# Altium schematic sheet Sheet1.SchDoc
size A2; SheetNumber: 1; SheetTotal: 1
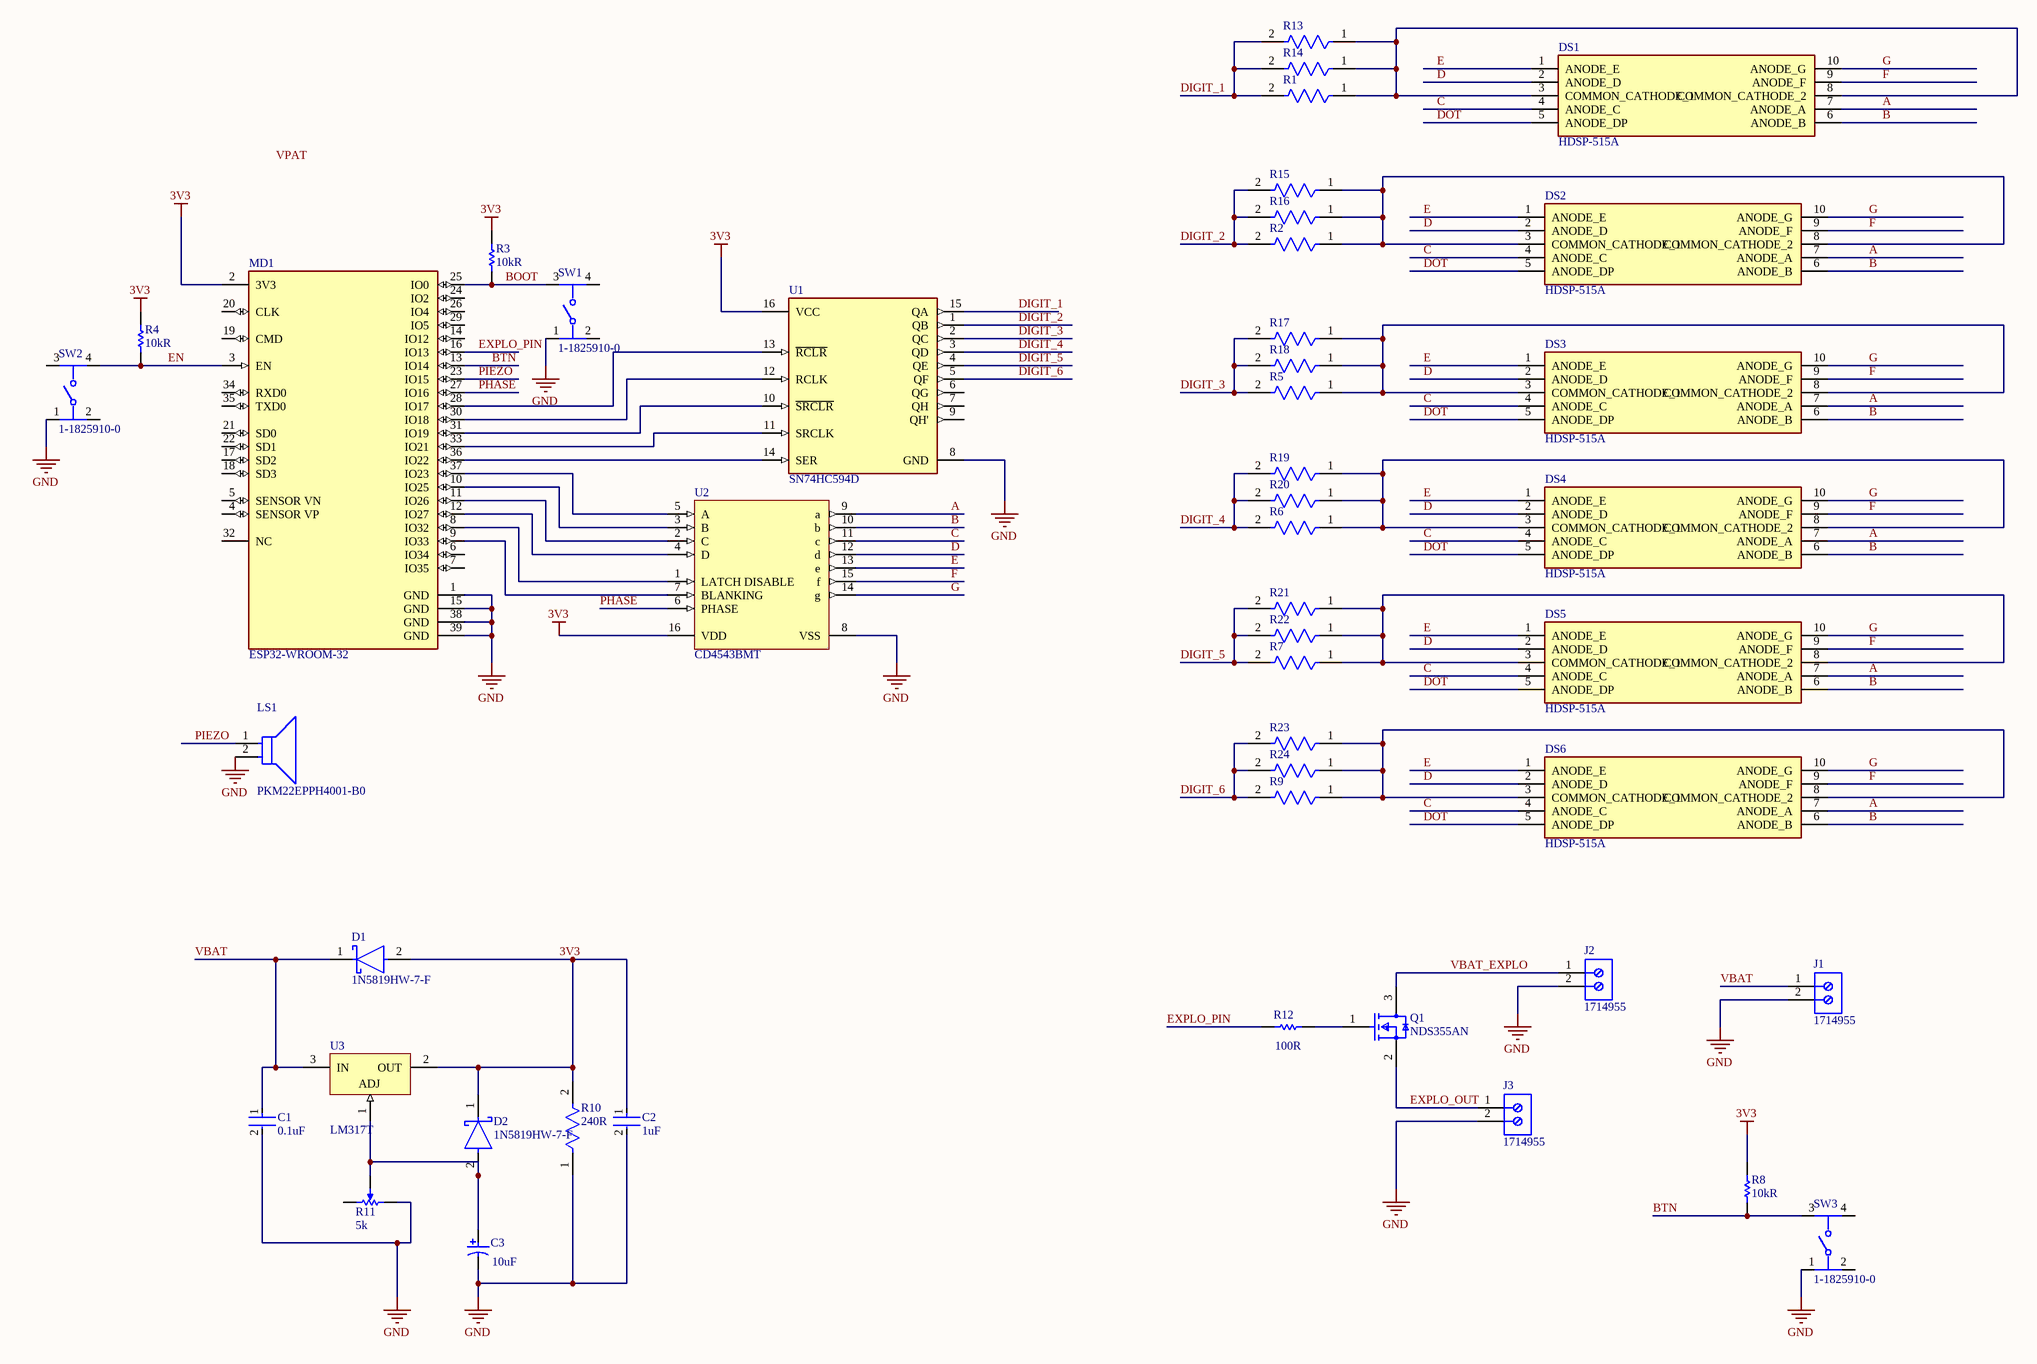
[diagram p0: Sheet1.SchDoc]

## Parts
C1  0.1uF  [FP-C0603C-CF-MFG]
C2  1uF  [FP-C0603C105K3PACTU-MFG]
C3  10uF  [NIC-CAPA2-6.3X5.8_V]
D1  1N5819HW-7-F  [FP-SOD123-IPC_A]
D2  1N5819HW-7-F  [FP-SOD123-IPC_A]
DS1  HDSP-515A  [DIPS1524W55P254L1240H800Q10N]
DS2  HDSP-515A  [DIPS1524W55P254L1240H800Q10N]
DS3  HDSP-515A  [DIPS1524W55P254L1240H800Q10N]
DS4  HDSP-515A  [DIPS1524W55P254L1240H800Q10N]
DS5  HDSP-515A  [DIPS1524W55P254L1240H800Q10N]
DS6  HDSP-515A  [DIPS1524W55P254L1240H800Q10N]
J1  1714955  [PHOE-1714955_V]
J2  1714955  [PHOE-1714955_V]
J3  1714955  [PHOE-1714955_V]
LS1  PKM22EPPH4001-B0  [FP-PKM22EPPH4001-B0-MFG]
MD1  ESP32-WROOM-32  [FP-ESP32-WROOM-32-MFG]
Q1  NDS355AN  [FP-527AG-01-IPC_C]
R1  ERJ-3EKF33R0V  [FP-ERJ3EK-MFG]  (value not drawn)
R2  ERJ-3EKF33R0V  [FP-ERJ3EK-MFG]  (value not drawn)
R3  10kR  [RESC1609X55X30LL15T15]
R4  10kR  [RESC1609X55X30LL15T15]
R5  ERJ-3EKF33R0V  [FP-ERJ3EK-MFG]  (value not drawn)
R6  ERJ-3EKF33R0V  [FP-ERJ3EK-MFG]  (value not drawn)
R7  ERJ-3EKF33R0V  [FP-ERJ3EK-MFG]  (value not drawn)
R8  10kR  [RESC1609X55X30LL15T15]
R9  ERJ-3EKF33R0V  [FP-ERJ3EK-MFG]  (value not drawn)
R10  240R  [FP-CRCW0603-e3-IPC_B]
R11  5k  [BOUR-3214W_V]
R12  100R  [RESC1609X55X30ML10T20]
R13  ERJ-3EKF33R0V  [FP-ERJ3EK-MFG]  (value not drawn)
R14  ERJ-3EKF33R0V  [FP-ERJ3EK-MFG]  (value not drawn)
R15  ERJ-3EKF33R0V  [FP-ERJ3EK-MFG]  (value not drawn)
R16  ERJ-3EKF33R0V  [FP-ERJ3EK-MFG]  (value not drawn)
R17  ERJ-3EKF33R0V  [FP-ERJ3EK-MFG]  (value not drawn)
R18  ERJ-3EKF33R0V  [FP-ERJ3EK-MFG]  (value not drawn)
R19  ERJ-3EKF33R0V  [FP-ERJ3EK-MFG]  (value not drawn)
R20  ERJ-3EKF33R0V  [FP-ERJ3EK-MFG]  (value not drawn)
R21  ERJ-3EKF33R0V  [FP-ERJ3EK-MFG]  (value not drawn)
R22  ERJ-3EKF33R0V  [FP-ERJ3EK-MFG]  (value not drawn)
R23  ERJ-3EKF33R0V  [FP-ERJ3EK-MFG]  (value not drawn)
R24  ERJ-3EKF33R0V  [FP-ERJ3EK-MFG]  (value not drawn)
SW1  1-1825910-0  [FP-1-1825910-0-MFG]
SW2  1-1825910-0  [FP-1-1825910-0-MFG]
SW3  1-1825910-0  [FP-1-1825910-0-MFG]
U1  SN74HC594D  [FP-D0016A-IPC_B]
U2  CD4543BMT  [D0016A_M]
U3  LM317T  [TO-220]

## Nets
3V3: C2.1 D1.2(A) D2.1(C) MD1.2(3V3) R3.2 R4.2 R8.2 R10.2 U1.16(VCC) U2.16(VDD) U3.2(OUT)
GND: C1.2 C2.2 C3.2 J1.2 J2.2 J3.2 LS1.2 MD1.1(GND) MD1.15(GND) MD1.38(GND) MD1.39(GND) R10.1 R11.1 SW1.1 SW2.1 SW3.1 U1.8(GND) U2.8(VSS)
A: DS1.7(ANODE_A) DS2.7(ANODE_A) DS3.7(ANODE_A) DS4.7(ANODE_A) DS5.7(ANODE_A) DS6.7(ANODE_A) U2.9(a)
B: DS1.6(ANODE_B) DS2.6(ANODE_B) DS3.6(ANODE_B) DS4.6(ANODE_B) DS5.6(ANODE_B) DS6.6(ANODE_B) U2.10(b)
BOOT: MD1.25(IO0) R3.1 SW1.3
BTN: MD1.13(IO14) R8.1 SW3.3
C: DS1.4(ANODE_C) DS2.4(ANODE_C) DS3.4(ANODE_C) DS4.4(ANODE_C) DS5.4(ANODE_C) DS6.4(ANODE_C) U2.11(c)
D: DS1.2(ANODE_D) DS2.2(ANODE_D) DS3.2(ANODE_D) DS4.2(ANODE_D) DS5.2(ANODE_D) DS6.2(ANODE_D) U2.12(d)
DIGIT_1: R1.2 R13.2 R14.2 U1.15(QA)
DIGIT_2: R2.2 R15.2 R16.2 U1.1(QB)
DIGIT_3: R5.2 R17.2 R18.2 U1.2(QC)
DIGIT_4: R6.2 R19.2 R20.2 U1.3(QD)
DIGIT_5: R7.2 R21.2 R22.2 U1.4(QE)
DIGIT_6: R9.2 R23.2 R24.2 U1.5(QF)
DOT: DS1.5(ANODE_DP) DS2.5(ANODE_DP) DS3.5(ANODE_DP) DS4.5(ANODE_DP) DS5.5(ANODE_DP) DS6.5(ANODE_DP)
E: DS1.1(ANODE_E) DS2.1(ANODE_E) DS3.1(ANODE_E) DS4.1(ANODE_E) DS5.1(ANODE_E) DS6.1(ANODE_E) U2.13(e)
EN: MD1.3(EN) R4.1 SW2.4
EXPLO_OUT: J3.1 Q1.2(S)
EXPLO_PIN: MD1.16(IO13) R12.1
F: DS1.9(ANODE_F) DS2.9(ANODE_F) DS3.9(ANODE_F) DS4.9(ANODE_F) DS5.9(ANODE_F) DS6.9(ANODE_F) U2.15(f)
G: DS1.10(ANODE_G) DS2.10(ANODE_G) DS3.10(ANODE_G) DS4.10(ANODE_G) DS5.10(ANODE_G) DS6.10(ANODE_G) U2.14(g)
PHASE: MD1.27(IO16) U2.6(PHASE)
PIEZO: LS1.1 MD1.23(IO15)
VBAT: C1.1 D1.1(C) J1.1 U3.3(IN)
VBAT_EXPLO: J2.1 Q1.3(D)
NetC3_1: C3.1 D2.2(A) R11.2 U3.1(ADJ)
NetDS1_3: DS1.3(COMMON_CATHODE_1) DS1.8(COMMON_CATHODE_2) R1.1 R13.1 R14.1
NetDS2_3: DS2.3(COMMON_CATHODE_1) DS2.8(COMMON_CATHODE_2) R2.1 R15.1 R16.1
NetDS3_3: DS3.3(COMMON_CATHODE_1) DS3.8(COMMON_CATHODE_2) R5.1 R17.1 R18.1
NetDS4_3: DS4.3(COMMON_CATHODE_1) DS4.8(COMMON_CATHODE_2) R6.1 R19.1 R20.1
NetDS5_3: DS5.3(COMMON_CATHODE_1) DS5.8(COMMON_CATHODE_2) R7.1 R21.1 R22.1
NetDS6_3: DS6.3(COMMON_CATHODE_1) DS6.8(COMMON_CATHODE_2) R9.1 R23.1 R24.1
NetMD1_8: MD1.8(IO32) U2.1(LATCH_DISABLE)
NetMD1_9: MD1.9(IO33) U2.7(BLANKING)
NetMD1_10: MD1.10(IO25) U2.3(B)
NetMD1_11: MD1.11(IO26) U2.2(C)
NetMD1_12: MD1.12(IO27) U2.4(D)
NetMD1_28: MD1.28(IO17) U1.13(~{RCLR})
NetMD1_30: MD1.30(IO18) U1.12(RCLK)
NetMD1_31: MD1.31(IO19) U1.10(~{SRCLR})
NetMD1_33: MD1.33(IO21) U1.11(SRCLK)
NetMD1_36: MD1.36(IO22) U1.14(SER)
NetMD1_37: MD1.37(IO23) U2.5(A)
NetQ1_1: Q1.1(G) R12.2

Not connected (* = marked no-connect by the designer): MD1 4(SENSOR_VP) 5(SENSOR_VN) 6(IO34) 7(IO35) 14(IO12) 17(SD2) 18(SD3) 19(CMD) 20(CLK) 21(SD0) 22(SD1) 24(IO2) 26(IO4) 29(IO5) 32(NC) 34(RXD0) 35(TXD0); R11 3; SW1 2 4; SW2 2 3; SW3 2 4; U1 6(QG) 7(QH) 9(QH')

## Notes on the sheet
- Labels drawn without touching a wire or pin: VPAT

## Library data of the parts
C1 = CMP-2006-03061-2: CAP CER 0.1UF 50V X7R 0603; Manufacturer: KEMET; Manufacturer Part Number: C0603C104K5RACTU; Tolerance: 0.1; Description: C0603 0.10 μF X7R 30ppm/°C 10.00% 50 V; Temperature Coefficient: 30ppm/°C; Material: Ceramic; Automotive Grade: Grade 1; Value: 0.10 μF; Temperature: -55°C to +125°C; RoHS: TRUE; Temperature Range High: +125°C; Lead Free: Yes; Octopart: https://octopart.com/c0603c104k5ractu-kemet-139244; Digikey Description: CAP CER 0.1UF 50V X7R 0603; Category: Cap; Package: C0603C-CF; ComponentLink2Description: Datasheet; Temperature Range Low: -55°C; Device Class L1: Passive Components; Voltage Rating: 50 V; Automotive: Yes; Device Class L3: Ceramic Capacitors; ComponentLink2URL: https://api.kemet.com/component-edge/download/datasheet/C0603C100J5GACAUTO.pdf; Capacitance: 0.10 μF; Device Class L2: Capacitors; Temperature Characteristic: X7R; Height: 0.87mm
C2 = CMP-2006-02216-3: CAP CER 1UF 25V X5R 0603; Dielectric Material: Ceramic; Tolerance: 10%; Contact Plating: Tin; Number of Pins: 2; Lead Free: Lead Free; Depth: 0.8mm; Length: 1.6mm; Mount: Surface Mount; Case Code (Metric): 1608; Max Operating Temperature: 85°C; Voltage: 25V; Voltage Rating (DC): 25V; REACH SVHC: No SVHC; Height: 0.8mm; Series: C0603C; Case/Package: 0603; Case Code (Imperial): 0603; Capacitance: 1uF; RoHS Compliant: Yes; Dielectric: X5R; Packaging: Tape and Reel; Construction: Flat; Thickness: 0.034inch; Voltage Rating: 25V; Radiation Hardening: No; Width: 0.031inch; Min Operating Temperature: -55°C; Termination: SMD/SMT; Package Quantity: 4000
C3 = CMP-0687-00043-1: Aluminum Electrolytic Capacitor, UD Series, Low Impedance, 10 uF, 50 V, + / - 20%, -55 to 105 degC, Chip Type, 6.3 x 5.8 mm D x L, Pb-Free, Reel; Manufacturer: Nichicon; PartNumber: UUD1H100MCL1GS; Impedance: 0.88 Ohm; Rated Voltage: 50 V; Endurance Time: 2000 h; Rated Ripple Current (at 100kHz): 165 mA; Packing: Dia382mm Reel; Tolerance Rated Capacitance: -20 to 20%; ComponentLink2Description: Datasheet; Length: 5.8 mm; ComponentLink2URL: http://products.nichicon.co.jp/en/pdf/XJA043/e-ud.pdf; RoHS: TRUE; DatasheetVersion: 08/2012; ComponentLink3URL: http://products.nichicon.co.jp/en/pdf/XJA043/e-ud.pdf; ComponentLink3Description: Package Specification; ComponentLink1Description: Manufacturer URL; Mounting Technology: Surface Mount; ComponentLink1URL: http://www.nichicon.co.jp/; PackageDescription: 2-Pin Surface Mount Device, Diameter 6.3 mm, Height 5.8 mm, Pitch 5.4 mm; Rated Capacitance: 10 uF; PackageReference: CAPAE-D6.3H5.8; Diameter: 6.3 mm
D1 D2 = CMP-0303-00003-3: DIODE SCHOTTKY 40V 1A SOD123; Forward Voltage: 450mV; Capacitance: 110pF; Max Forward Surge Current (Ifsm): 25A; Peak Reverse Current: 50uA; Polarity: Standard; Element Configuration: Single; Max Power Dissipation: 450mW; Min Operating Temperature: -65°C; Package Quantity: 3000; Contact Plating: Tin; Weight: 0.000353oz; Max Repetitive Reverse Voltage (Vrrm): 40V; Max Reverse Voltage (DC): 40V; Height: 1.25mm; Average Rectified Current: 1A; Width: 1.7mm; Case/Package: SOD-123-2; Lead Free: Lead Free; Max Operating Temperature: 125°C; Current Rating: 1A; Termination: SMD/SMT; Forward Current: 1A; Radiation Hardening: No; Number of Pins: 2; Length: 2.85mm; Voltage Rating (DC): 40V; REACH SVHC: No SVHC; Peak Non-Repetitive Surge Current: 25A; Packaging: Tape and Reel; Output Current: 1A
DS1-DS6 = HDSP-515A: Display; Manufacturer_Name: Avago Technologies; Height: 8mm; Manufacturer_Part_Number: HDSP-515A; Mouser Part Number: 630-HDSP-515A; Mouser Price/Stock: https://www.mouser.co.uk/ProductDetail/Broadcom-Avago/HDSP-515A?qs=T3oQrply3y8Gvd653rH%2Fgg%3D%3D
J1-J3 = CMP-2000-05797-1: PC Terminal Block, Pitch 6.35 mm, 1 x 2 Position, Height 21.5 mm, Tail Lenght 5.1 mm, RoHS, Bulk; Manufacturer: Phoenix Contact; Package Description: PC Terminal Block, Pitch 6.35 mm, 1 x 2 Position, Height 21.5 mm, Tail Lenght 5.1 mm; Datasheet URL: http://media.digikey.com/pdf/Data%20Sheets/Phoenix%20Contact%20PDFs/1714955.pdf; Package Reference: 1714955; Manufacturer URL: http://www.phoenixcontact.com/; Datasheet Version: 02/2010; Mounting Technology: ThroughHole
LS1 = CMP-2000-06903-2: AUDIO PIEZO TRANSDUCER 30V TH; Voltage Rating: 3V; Frequency: 4kHz; Capacitance: 12nF; Max Supply Voltage: 25V; Washable: No; Packaging: Bulk; Mount: Through Hole; Height: 7mm; Diameter: 22mm; Min Operating Temperature: -20°C; Self Resonant Frequency: 4kHz; Package Quantity: 900; Lead Free: Lead Free; REACH SVHC: No SVHC; Termination: Solder; Nominal Input Voltage: 3V; Max Frequency: 4kHz; Radiation Hardening: No; Max Operating Temperature: 70°C
MD1 = CMP-194065-000008-1: RX TXRX MOD WIFI SURFACE MOUNT; Frequency: 2.5GHz; Sensitivity: -98dBm; Operating Supply Voltage: 3.6V; Data Rate: 150Mbps; Weight: 0.088185oz; Package Quantity: 550; Min Operating Temperature: -40°C; Mount: Surface Mount; Max Operating Temperature: 85°C; Packaging: Cut Tape; Case/Package: SMD/SMT
Q1 = CMP-2000-06834-2: MOSFET N-CH 30V 1.7A SSOT3; Manufacturer: ON Semiconductor; Gate To Source Voltage: 20V; Threshold Vgs Min: 1V; Pulse Drain Current: 10A; Number Of N Channels: 1; Typ Forward Diode Voltage: 0.8V; Input Capacitace At Vds: 195pF @ 15V; Turn Off Delay Time: 13ns; Gate Charge At Vgs: 3.5nC @ 5V; Rthja Max: 250°C/W; Standoff Height: 0.013mm; Max Forward Diode Voltage: 1.2V; Power Dissipation: 0.46W; Depletion Mode: False; Threshold Vgs Max: 2V; Drain To Source Resistance: 0.105Ω; Turn On Delay Time: 10ns; Max Junction Temp: +150°C; Transconductance: 3.5S; Automotive: No; Drain To Source Voltage: 30V; Temperature: -55°C to +150°C; Device Class L1: Discrete Semiconductors; Number Of Channels: 1; Octopart: https://octopart.com/nds355an-on+semiconductor-84330922; Temperature Range High: +150°C; Category: Trans; Manufacturer Part Number: NDS355AN; Device Class L2: Transistors; RoHS: TRUE; Digikey Description: MOSFET N-CH 30V 1.7A SSOT3; Drain To Source Breakdown Voltage: 30V; Height: 1.22mm; Mouser Description: MOSFET SOT-23 N-CH LOGIC; Temperature Range Low: -55°C; ComponentLink2URL: https://www.onsemi.com/pub/Collateral/NDS355AN-D.PDF; ComponentLink2Description: Datasheet; Continuous Drain Current: 1.7A; Package: 527AG-01; Device Class L3: MOSFETs; Lead Free: Yes; Footprint Url: https://www.onsemi.com/pub/Collateral/527AG.PDF
R1 R2 R5-R7 R9 R13-R24 = CMP-2000-00443-2: RES SMD 33 OHM 1% 1/10W 0603; Voltage Rating (DC): 75V; Power Rating: 100mW; Resistance: 33R; Temperature Coefficient: 100ppm/°C; Min Operating Temperature: -55°C; Packaging: Tape and Reel; Mount: Surface Mount; Lead Free: Lead Free; Voltage Rating: 75V; Features: Automotive AEC-Q200; Height: 0.022inch; Width: 0.031inch; Number of Pins: 2; Package Quantity: 1; Case Code (Metric): 1608; Max Power Dissipation: 100mW; Case Code (Imperial): 0603; Termination: SMD/SMT; Resistance Tolerance: 1%; Max Operating Temperature: 155°C; Tolerance: 1%; Length: 1.6mm; Case/Package: 0603; Military Standard: Not; RoHS Compliant: Yes; Series: ERJ; Size Code: 0603; Construction: Rectangular; Number of Terminations: 2; Radiation Hardening: No; Resistor Type: Thick Film; Contact Plating: Tin; Depth: 0.8mm; REACH SVHC: No SVHC
R3 R4 R8 = CMP-1012-00623-3: Chip Resistor, 10 KOhm, +/- 1%, 0.1 W, -55 to 155 degC, 0603 (1608 Metric), RoHS, Tape and Reel; Manufacturer: Panasonic; Voltage Rating: 75V; Case\/Package: 0603; Power Rating: 100mW; Resistance: 10KOhm; Temperature Coefficient: 100ppm\/degreesC; Number of Pins: 2; Package Reference: 603; Depth: 0.8mm; Mount: SurfaceMount; Package Description: 2-Pin Surface Mount Device, Body 1.6 x 0.85 mm; Datasheet Version: 02/2017; Length: 1.6mm; Lead Free: LeadFree; Height: 0.45mm; Number of Terminations: 2; Max Power Dissipation: 100mW; Min Operating Temperature: -55degC; Datasheet URL: https://industrial.panasonic.com/cdbs/www-data/pdf/RDA0000/AOA0000C304.pdf; Termination: SMD/SMT; Case Code (Metric): 1608; Case Code (Imperial): 0603; Tolerance: 1%; Max Operating Temperature: 155degC; RoHSCompliant: true; Voltage Rating (DC): 75V; Radiation Hardening: No; Packaging: TapeandReel; Composition: ThickFilm; Mounting Technology: SurfaceMount; Manufacturer URL: http://www.panasonic.com/; Width: 0.031inch; REACH SVHC: NoSVHC; Contact Plating: Tin; Military Standard: Not; Package Quantity: 1
R10 = CMP-2000-03111-2: RES Thick Film, 240Ω, 1%, 0.1W, 100ppm/°C, 0603; Power Rating: 100mW; Voltage Rating: 75V; Packaging: Tape and Reel; Radiation Hardening: No; Contact Plating: Tin; Height: 0.45mm; Case Code (Metric): 1608; Tolerance: 1%; Construction: Rectangular; Temperature Coefficient: 100ppm/°C; Case/Package: 0603; Resistor Type: Thick Film; Length: 1.55mm; Weight: 7.1E-05oz; Features: Automotive AEC-Q200; Width: 0.033inch; Termination: SMD/SMT; Mount: Surface Mount; Max Operating Temperature: 155°C; Lead Free: Lead Free; Resistance: 240R; Military Standard: Not; Number of Terminations: 2; RoHS Compliant: Yes; Case Code (Imperial): 0603; Resistance Tolerance: 1%; Size Code: 0603; Max Power Dissipation: 100mW; Min Operating Temperature: -55°C; Series: CRCW; Package Quantity: 10; Voltage Rating (DC): 75V; Technology: THICK FILM; Depth: 0.85mm
R11 = CMP-2000-05579-1: 3214 - 5-Turn Trimpot(R) Trimming Potentiometer, 5 KOhm, +/- 10%, 0.25 W, -65 to 150 degC, RoHS, Tape and Reel; Manufacturer: Bourns; Temperature Coefficient: ±100ppm/°C; Power Rating: 250mW; No. of Turns: 5; Track Resistance: 5kohm; SVHC: NoSVHC(16-Jun-2014); Potentiometer Mounting: SMD; Manufacturer URL: http://www.bourns.com/; Resistance Tolerance: ±10%; Datasheet URL: http://www.bourns.com/docs/Product-Datasheets/3214.pdf; ROHS COMPLIANT: Yes; Mounting Technology: SurfaceMount; Datasheet Version: 05/2016; Package Reference: 3214W; Package Description: 3-Pin Surface Mount Device, Body 3.5 x 4.8 mm, Pitch 1.25 mm
R12 = CMP-2000-03688-1: Manufacturer: Vishay Dale; Part Number: TNPW0603100RBEEA
SW1-SW3 = CMP-03407-000018-1: SWITCH TACTILE SPST-NO 0.05A 24V; Switch Function: Off-Mom; Mechanical Life: 100000Cycles; Actuator Material: Nylon; Actuator Color: Blue; Contact Current Rating: 50mA; Illumination Type: Non-Illuminated; Throw Configuration: SPST; Actuator Length: 3.4mm; Operating Force: 1.56N; Actuator Type: Standard; Contact Resistance: 100mR; Switch Travel: 0.25mm; Depth: 5.99mm; Contact Plating: Silver; Max Operating Temperature: 85°C; Electrical Life: 100000Cycles; Min Operating Temperature: -35°C; RoHS Compliant: Yes; Max Voltage Rating (DC): 24V; Mount: Through Hole; Packaging: Loose Piece; Length: 5.99mm; Series: FSMJ, Alcoswitch; Orientation: Straight; Contact Material: Brass; Radiation Hardening: No; Package Quantity: 750; Max Current Rating: 50mA; Termination: PC Pins; Type: Switch; Voltage Rating (DC): 24V
U1 = CMP-0780-00060-4: IC 8-BIT SHIFT REGISTER 16-SOIC; Number of Circuits: 4; Propagation Delay: 185ns; Number of Elements: 1; Number of Bits per Element: 8; Direction: Unidirectional; Max Supply Voltage: 6V; Min Supply Voltage: 2V; Operating Supply Voltage: 5V; Number of Output Lines: 10; Number of Pins: 16; Width: 3.91mm; Lead Free: Lead Free; REACH SVHC: No SVHC; Max Operating Temperature: 125°C; Package Quantity: 40; Technology: CMOS; Weight: 0.004998oz; Packaging: Rail/Tube; Length: 9.9mm; Turn-On Delay Time: 185ns; Mount: Surface Mount; Radiation Hardening: No; Height: 1.58mm; Number of Bits: 8; Series: 74HC; Logic Function: Shift Register; Case/Package: SOIC; Min Operating Temperature: -40°C
U2 = CMP-0388-00034-2: CMOS BCD-to-7-Segment Latch / Decoder / Driver for Liquid-Crystal Displays, 3 V, -55 to 125 degC, 16-pin SOIC (D16), Green (RoHS & no Sb/Br); Manufacturer: Texas Instruments; SubFamily: Discrete Segment LED Driver; Rating: Catalog; Vin(Min)(V): 3; Mounting Technology: Surface Mount; ComponentLink2Description: Datasheet; Code_JEDEC: MS-012; PackageReference: D0016A; ComponentLink2URL: http://www.ti.com/general/docs/lit/getliterature.tsp?genericPartNumber=CD4543B&fileType=pdf; PackageDescription: 16-Pin Plastic Small Outline, Body 9.90 x 3.90 mm, Pitch 1.27 mm; Eco-Plan: Green (RoHS & no Sb/Br); DatasheetVersion: SCHS086D; ComponentLink1URL: http://www.ti.com/; PartNumber: CD4543BMT; ComponentLink3Description: Package Specification; PackageVersion: 4040047-6/M; ComponentLink3URL: http://www.ti.com/litv/pdf/mpds178g; ComponentLink1Description: Manufacturer URL
U3 = CMP-0244-00444-1: 1.5A, 1.2V to 37V Adjustable Voltage Regulator, 3-Pin TO-220; PackageVersion: 2011; ComponentLink1URL: http://www.st.com; ComponentLink2URL: http://www.st.com/internet/com/TECHNICAL_RESOURCES/TECHNICAL_LITERATURE/DATASHEET/CD00000455.pdf; PackageDescription: TO, Thru-Hole, Vertical, Heatsink Mounted; 3 In-Line Leads; Pitch 2.54 mm; PackageReference: TO-220; ComponentLink1Description: Manufacturer URL; ComponentLink3URL: http://www.st.com/internet/com/TECHNICAL_RESOURCES/TECHNICAL_LITERATURE/PACKAGE_INFORMATION/CD00004649.pdf; DatasheetVersion: 1/11/2011; ComponentLink2Description: Datasheet; ComponentLink3Description: Package Specification